# EAGLE design snowflake-r2 (EAGLE 5.12)
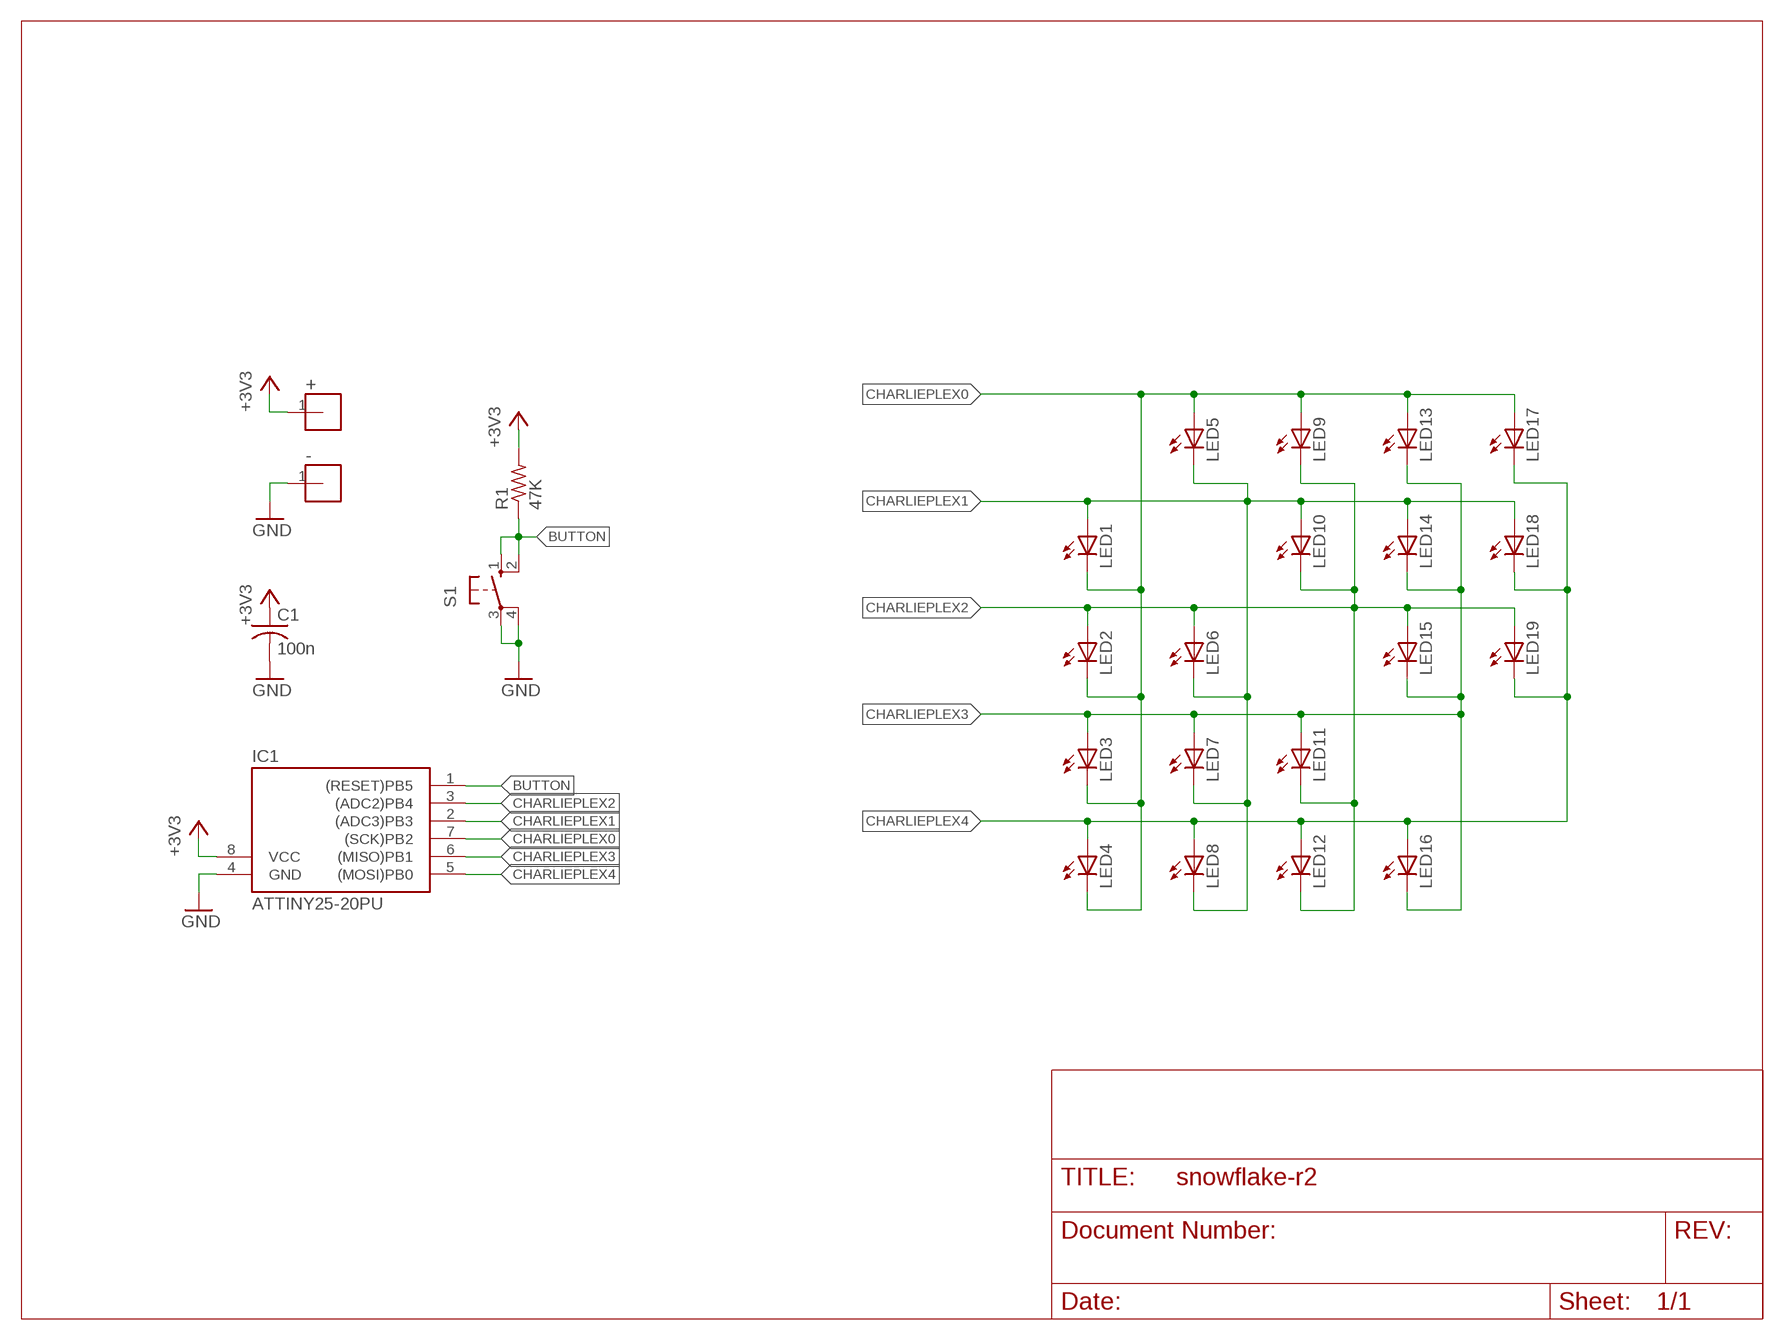
[diagram p0: schematic, sheet 1]

## Parts
+  M01-100MIL  [100MIL-1]
-  M01-100MIL  [100MIL-1]
C1  100n  C-US050-025X075  [C050-025X075]
IC1  ATTINY25-20PU  TINY138P3  [DIL08]
LED1  LED3MM  [LED3MM]
LED2  LED3MM  [LED3MM]
LED3  LED3MM  [LED3MM]
LED4  LED3MM  [LED3MM]
LED5  LED3MM  [LED3MM]
LED6  LED3MM  [LED3MM]
LED7  LED3MM  [LED3MM]
LED8  LED3MM  [LED3MM]
LED9  LED3MM  [LED3MM]
LED10  LED3MM  [LED3MM]
LED11  LED3MM  [LED3MM]
LED12  LED3MM  [LED3MM]
LED13  LED3MM  [LED3MM]
LED14  LED3MM  [LED3MM]
LED15  LED3MM  [LED3MM]
LED16  LED3MM  [LED3MM]
LED17  LED3MM  [LED3MM]
LED18  LED3MM  [LED3MM]
LED19  LED3MM  [LED3MM]
R1  47K  R-US_0207/10  [0207/10]
S1  10-XX  [B3F-10XX]

## Nets
+3V3: +.1 C1.1 IC1.8(VCC) R1.2
BUTTON: IC1.1((RESET)PB5) R1.1 S1.1(S) S1.2(S1)
CHARLIEPLEX0: IC1.7((SCK)PB2) LED1.K(C) LED2.K(C) LED3.K(C) LED4.K(C) LED5.A LED9.A LED13.A LED17.A
CHARLIEPLEX1: IC1.2((ADC3)PB3) LED1.A LED5.K(C) LED6.K(C) LED7.K(C) LED8.K(C) LED10.A LED14.A LED18.A
CHARLIEPLEX2: IC1.3((ADC2)PB4) LED2.A LED6.A LED9.K(C) LED10.K(C) LED11.K(C) LED12.K(C) LED15.A LED19.A
CHARLIEPLEX3: IC1.6((MISO)PB1) LED3.A LED7.A LED11.A LED13.K(C) LED14.K(C) LED15.K(C) LED16.K(C)
CHARLIEPLEX4: IC1.5((MOSI)PB0) LED4.A LED8.A LED12.A LED16.A LED17.K(C) LED18.K(C) LED19.K(C)
GND: -.1 C1.2 IC1.4(GND) S1.3(P) S1.4(P1)

## Library data of the parts
+ - = rbg-generic-headers:M01-100MIL
C1 = rcl:C-US: CAPACITOR, American symbol
IC1 = avr-5:TINY13*
LED1-LED19 = led:LED: LED OSRAM: - CHIPLED LG R971, LG N971, LY N971, LG Q971, LY Q971, LO R971, LY R971 LH N974, LH R974 LS Q976, LO Q976, LY Q976 LO Q996 - Hyper CHIPLED LW Q18S LB Q993, LB Q99A, LB R99A - SideLED LS A670, LO A670, LY A670, LG A670, LP A670 LB A673, LV A673, LT A673, LW A673 LH A674 LY A675 LS A676, LA A676, LO A676, LY A676, LW A676 LS A679, LY A679, LG A679 - Hyper Micro SIDELED® LS Y876, LA Y876, LO Y876, LY Y876 LT Y87S - SmartLED LW L88C, LW L88S LB L89C, LB L89S, LG L890 LS L89K, LO L89K, LY L89K LS L896, LA L896, LO L896, LY L896 - TOPLED LS T670, LO T670, LY T670, LG T670, LP T670 LSG T670, LSP T670, LSY T670, LOP T670, LYG T670 LG T671, LOG T671, LSG T671 LB T673, LV T673, LT T673, LW T673 LH T674 LS T676, LA T676, LO T676, LY T676, LB T676, LH T676, LSB T676, LW T676 LB T67C, LV T67C, LT T67C, LS T67K, LO T67K, LY T67K, LW E67C LS E67B, LA E67B, LO E67B, LY E67B, LB E67C, LV E67C, LT E67C LW T67C LS T679, LY T679, LG T679 LS T770, LO T770, LY T770, LG T770, LP T770 LB T773, LV T773, LT T773, LW T773 LH T774 LS E675, LA E675, LY E675, LS T675 LS T776, LA T776, LO T776, LY T776, LB T776 LHGB T686 LT T68C, LB T68C - Hyper Mini TOPLED® LB M676 - Mini TOPLED Santana® LG M470 LS M47K, LO M47K, LY M47K Source: http://www.osram.convergy.de LUXEON: - LUMILED® LXK2-PW12-R00, LXK2-PW12-S00, LXK2-PW14-U00, LXK2-PW14-V00 LXK2-PM12-R00, LXK2-PM12-S00, LXK2-PM14-U00 LXK2-PE12-Q00, LXK2-PE12-R00, LXK2-PE12-S00, LXK2-PE14-T00, LXK2-PE14-U00 LXK2-PB12-K00, LXK2-PB12-L00, LXK2-PB12-M00, LXK2-PB14-N00, LXK2-PB14-P00, LXK2-PB14-Q00 LXK2-PR12-L00, LXK2-PR12-M00, LXK2-PR14-Q00, LXK2-PR14-R00 LXK2-PD12-Q00, LXK2-PD12-R00, LXK2-PD12-S00 LXK2-PH12-R00, LXK2-PH12-S00 LXK2-PL12-P00, LXK2-PL12-Q00, LXK2-PL12-R00 Source: www.luxeon.com KINGBRIGHT: KA-3528ASYC Source: www.kingbright.com
R1 = rcl:R-US_: RESISTOR, American symbol
S1 = rbg-generic-tact-switch:10-XX: OMRON SWITCH

## Board
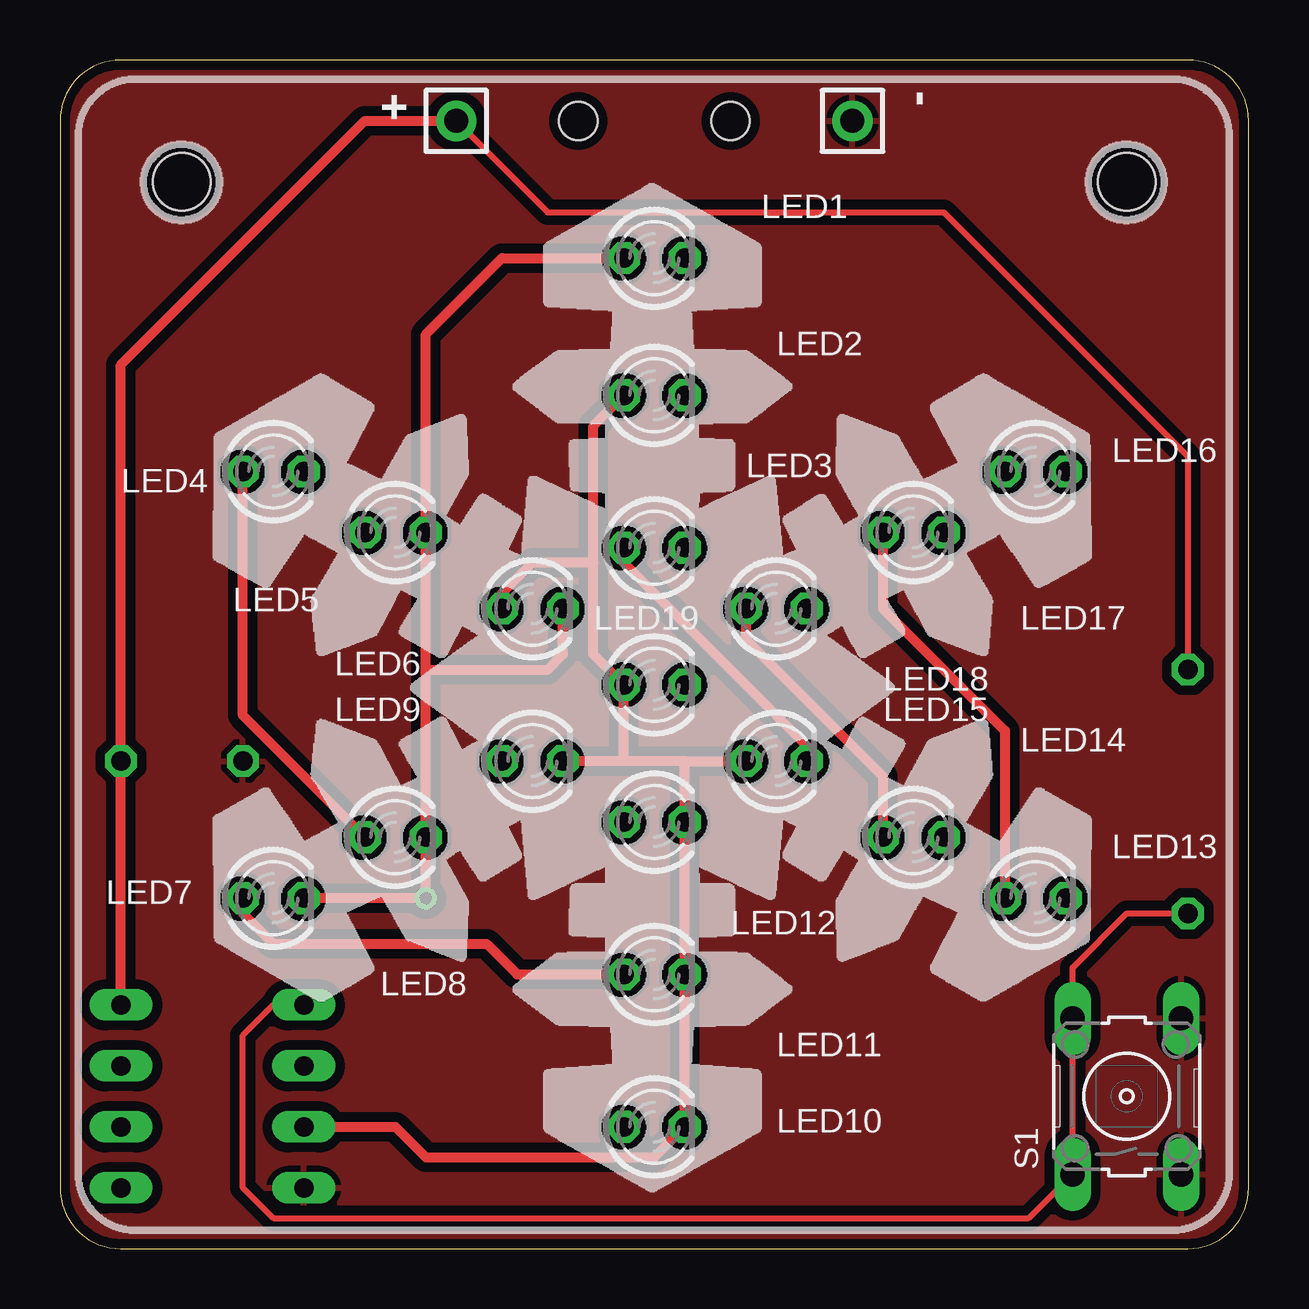
[diagram p1: board, top side]
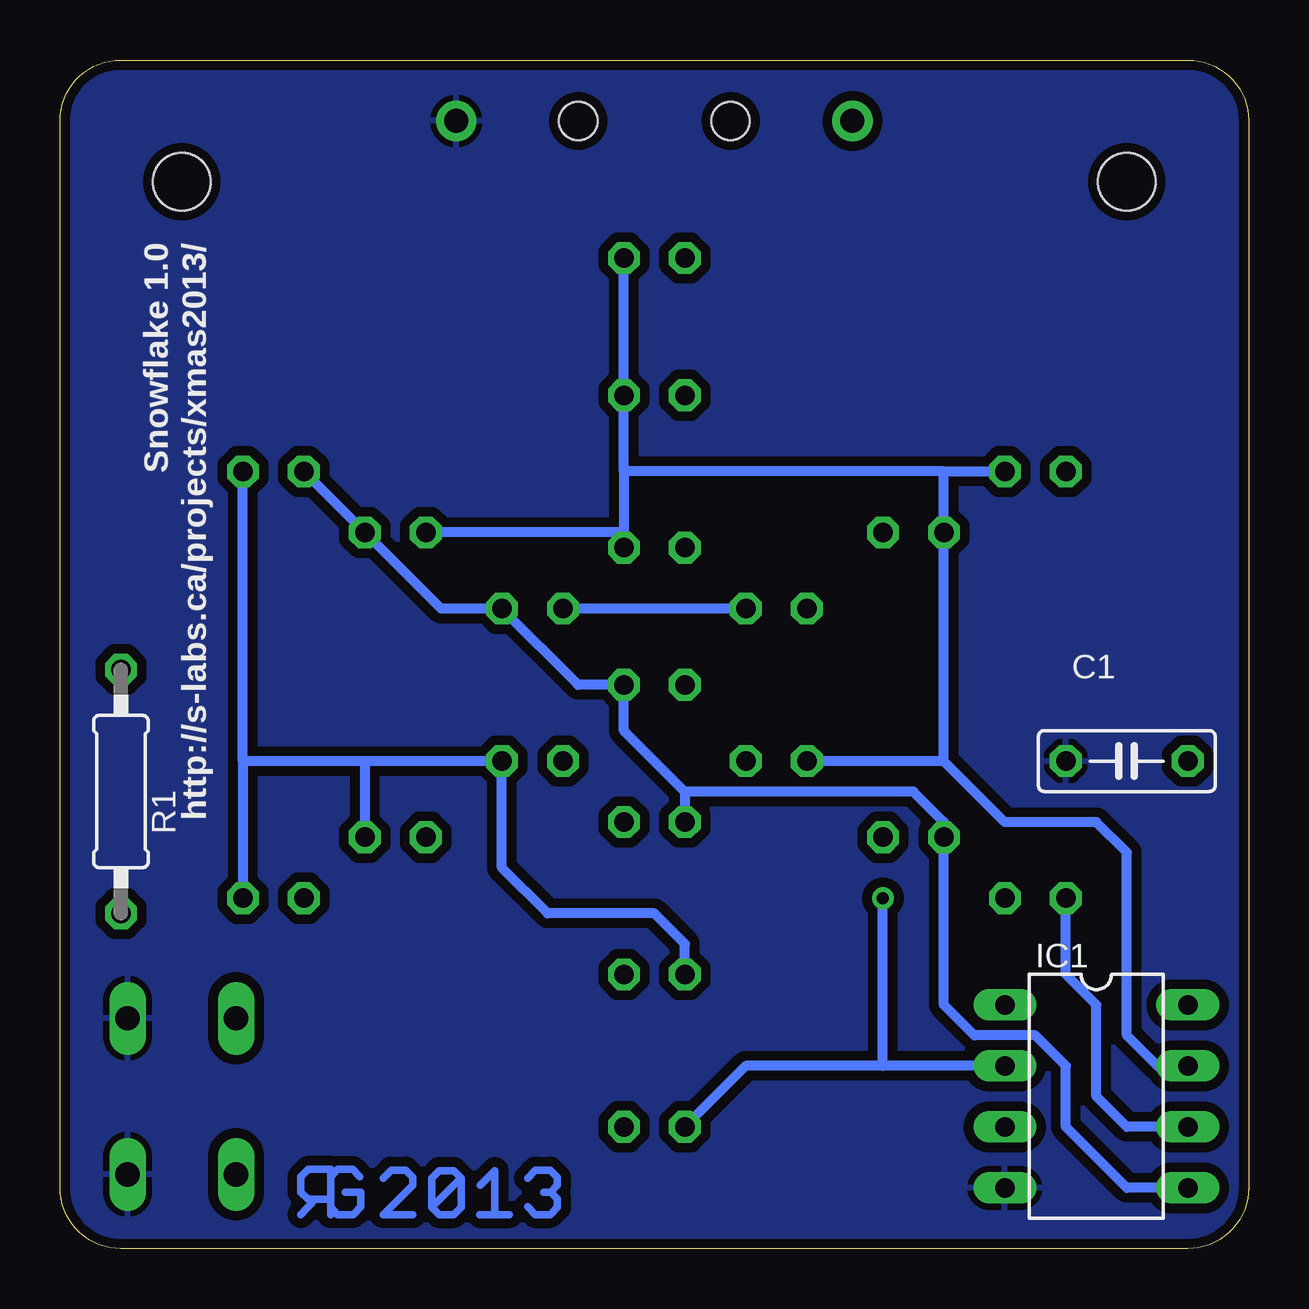
[diagram p2: board, bottom side, seen from below]

Size 49.53 x 49.53 mm. Coordinates in mm from the lower left corner, seen from the top.
Outline: 46.99,0 arc90 49.53,2.54 49.53,46.99 arc90 46.99,49.53 2.54,49.53 arc90 0,46.99 0,2.54 arc90 2.54,0 46.99,0
Copper layers (1*16): Top 0.035mm / dielectric 1.5mm / Bottom 0.035mm
Design rules "default *": minimum track width 10mil, minimum drill 0.5mm, track to track 8mil, track to pad 8mil, pad to pad 8mil, via to via 8mil, smd to smd 8mil, copper to edge 10mil, drill to drill 8mil, minimum pad ring 10mil, minimum via ring 8mil, stop-mask expansion 4mil, vias tented up to drill 20mil, thermal gap 10mil
Holes 2.4 mm at 5.08,44.45 44.45,44.45
Holes 1.6 mm at 21.59,46.99 27.94,46.99

### Footprints (pad centres in the part's own frame; a part is rotated, then mirrored left to right if it is on the bottom)
100MIL-1 = drill 1 pad 1.676 round: 1 0,0
C050-025X075 = drill 0.813 octagon: 1 -2.54,0; 2 2.54,0
DIL08 = drill 0.813 long: 1 -3.81,-3.81; 2 -1.27,-3.81; 3 1.27,-3.81; 4 3.81,-3.81; 5 3.81,3.81; 6 1.27,3.81; 7 -1.27,3.81; 8 -3.81,3.81
LED3MM = drill 0.813 octagon: A -1.27,0; K 1.27,0
0207/10 = drill 0.813 octagon: 1 -5.08,0; 2 5.08,0
B3F-10XX = drill 1.016 long: 1 -3.251,2.261; 2 3.251,2.261; 3 -3.251,-2.261; 4 3.251,-2.261

### Placement (x,y rotation side)
+  16.51,46.99 90 top
-  33.02,46.99 270 top
C1  5.08,20.32 180 bottom
IC1  6.35,6.35 270 bottom
LED1  24.77,41.27 0 top
LED2  24.77,35.56 0 top
LED3  24.77,29.21 0 top
LED4  8.89,32.38 0 top
LED5  13.97,29.84 0 top
LED6  19.68,26.67 0 top
LED7  8.89,14.61 0 top
LED8  13.97,17.14 0 top
LED9  19.68,20.32 0 top
LED10  24.77,5.08 0 top
LED11  24.77,11.43 0 top
LED12  24.77,17.78 0 top
LED13  40.64,14.61 0 top
LED14  35.56,17.14 0 top
LED15  29.84,20.32 0 top
LED16  40.64,32.38 0 top
LED17  35.56,29.84 0 top
LED18  29.84,26.67 0 top
LED19  24.77,23.5 0 top
R1  46.99,19.05 90 bottom
S1  44.45,6.35 90 top
U$1  [SNOWFLAKE]  0.64,0.64 0 top
U$2  [RGLOGO_SMALL_2013]  38.1,1.27 0 bottom

### Tracks (layer width: path | path; a pad name or v marks a point on that pad's centre or on a via)
+3V3
  Top 0.254: R1.2 46.99,33.02 36.83,43.18 20.32,43.18 +.1
  Top 0.406: IC1.8 C1.1 2.54,36.83 12.7,46.99 +.1
BUTTON
  Top 0.254: R1.1 44.45,13.97 42.19,11.71 S1.2 S1.1 40.36,1.27 8.89,1.27 7.62,2.54 7.62,8.89 8.89,10.16 IC1.1
CHARLIEPLEX0
  Top 0.406: LED13.A 39.37,21.59 34.29,26.67 LED17.A
  Bottom 0.406: LED1.K LED2.K 26.04,32.38 | 26.04,29.84 LED3.K | 26.04,32.38 26.04,29.84 | 26.04,29.84 LED17.A | 12.7,32.38 LED4.K | 12.7,32.38 26.04,32.38 | 12.7,32.38 LED5.A 12.7,20.32 | 12.7,20.32 10.16,17.78 6.35,17.78 5.08,16.51 5.08,8.89 3.81,7.62 IC1.7 | 12.7,20.32 LED9.A
CHARLIEPLEX1  (via drill 0.5)
  Top 0.406: LED7.K v15.24,14.61 LED8.K 15.24,24.13 | 15.24,24.13 LED5.K 15.24,38.1 18.41,41.27 LED1.A | LED6.K 20.95,24.77 20.32,24.13 15.24,24.13 | LED14.A 34.29,19.68 28.57,25.4 LED18.A
  Bottom 0.406: 15.24,7.62 20.95,7.62 LED10.A | IC1.2 15.24,7.62 | 15.24,7.62 v15.24,14.61 | LED6.K LED18.A
CHARLIEPLEX2
  Top 0.406: 26.04,20.32 23.5,20.32 | 23.5,20.32 LED9.K | 26.04,20.32 LED15.A | 26.04,20.32 LED12.K LED11.K LED10.K 24.77,3.81 15.24,3.81 13.97,5.08 IC1.3 | 23.5,20.32 LED19.A 22.23,24.77 22.23,28.57 | 22.23,28.57 22.23,34.29 LED2.A | LED6.A 18.41,27.3 19.68,28.57 22.23,28.57
CHARLIEPLEX3
  Top 0.406: LED3.A 23.5,28.57 31.11,20.95 LED15.K | LED11.A 19.05,11.43 17.78,12.7 8.89,12.7 7.62,13.97 LED7.A
  Bottom 0.406: 36.83,20.32 LED15.K 31.11,15.88 29.21,13.97 24.77,13.97 23.5,12.7 LED11.A | 36.83,20.32 41.91,20.32 | 41.91,20.32 LED13.K | 41.91,20.32 LED16.K | 36.83,20.32 LED14.K | IC1.6 5.08,5.08 6.35,6.35 6.35,10.16 7.62,11.43 LED7.A
CHARLIEPLEX4
  Top 0.406: LED4.A 7.62,22.23 LED8.A
  Bottom 0.406: LED16.A LED17.K 33.66,26.67 LED18.K 27.94,23.5 LED19.K 26.04,21.59 23.5,19.05 | 23.5,19.05 LED12.A | 23.5,19.05 13.97,19.05 12.7,17.78 LED8.A 12.7,10.16 11.43,8.89 8.89,8.89 7.62,7.62 7.62,5.08 5.08,2.54 IC1.5
GND
  pour Top (isolate 0.406): -1.27,50.8 50.8,50.8 50.8,-1.27 -1.27,-1.27
  pour Bottom (isolate 0.406): -1.27,50.8 50.8,50.8 50.8,-1.27 -1.27,-1.27

### Text on the board
bPlace: http://s-labs.ca/projects/xmas2013/ | Snowflake 1.0